# Altium project PCB_Project_3.PrjPcb
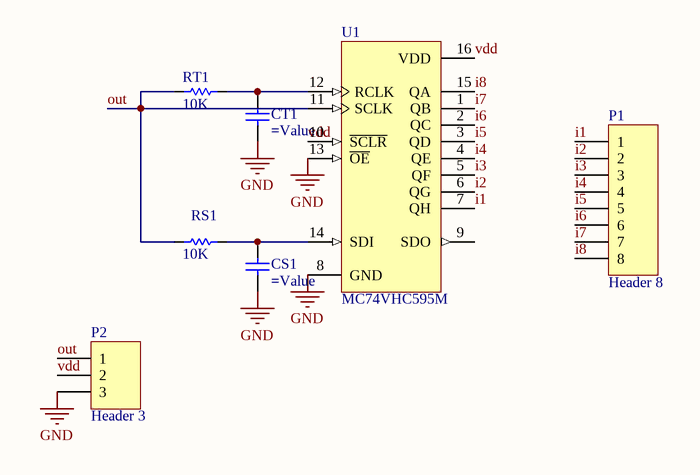
[diagram p0: iotv3 595.SchDoc]
1 sheet, 7 parts. Net scope: global (net labels, ports and power ports of the same name join across sheets).
Board file: iotv3 595.PcbDoc

## Sheet iotv3 595.SchDoc
size A

### Parts
CS1  (no value)  [CAP 1206]
CT1  (no value)  [CAP 1206]
P1  Header 8  [HDR1X8]
P2  Header 3  [HDR1X3]
RS1  10K  [RES 1206 (3216X08L)]
RT1  10K  [RES 1206 (3216X08L)]
U1  MC74VHC595M  [966-01_N]

### Nets
GND: CS1.2(-) CT1.2(-) P2.3 U1.8(GND) U1.13(~{OE})
i1: P1.1 U1.7(QH)
i2: P1.2 U1.6(QG)
i3: P1.3 U1.5(QF)
i4: P1.4 U1.4(QE)
i5: P1.5 U1.3(QD)
i6: P1.6 U1.2(QC)
i7: P1.7 U1.1(QB)
i8: P1.8 U1.15(QA)
out: P2.1 RS1.1 RT1.1 U1.11(SCLK)
vdd: P2.2 U1.10(~{SCLR}) U1.16(VDD)
NetCS1_1: CS1.1(+) RS1.2 U1.14(SDI)
NetCT1_1: CT1.1(+) RT1.2 U1.12(RCLK)

Not connected (* = marked no-connect by the designer): U1 9(SDO)

### Library data of the parts
CS1 CT1 = Capacitor
P1 = Header 8: Header, 8-Pin; LatestRevisionDate: 17-Jul-2002; LatestRevisionNote: Re-released for DXP Platform.; Publisher: Altium Limited
P2 = Header 3: Header, 3-Pin; LatestRevisionDate: 17-Jul-2002; LatestRevisionNote: Re-released for DXP Platform.; Publisher: Altium Limited
RS1 RT1 = Resistor: Tolerance: 5%; Power: 1/4 W; Value: 10K
U1 = MC74VHC595M: 8-Bit 3-State Shift Register with Output Storage Register; ComponentAvailability: Not for New Design; Published: 15-Apr-2002; LatestRevisionDate: 13-Apr-2006; LatestRevisionNote: IPC-7351 Footprint Added.; DatasheetVersion: 1997; PackageVersion: 1997; PackageReference: 966-01; Publisher: Altium Limited; PackageDescription: 16-Pin Small Outline Package 1.27 mm Pitch; ComponentLink1Description: Manufacturer Link; ComponentLink1URL: http://www.onsemi.com/; ComponentLink2Description: Datasheet; ComponentLink2URL: http://www.onsemi.com/pub/Collateral/MC74VHC595-D.PDF